# Altium schematic sheet Sensors.SchDoc
size A
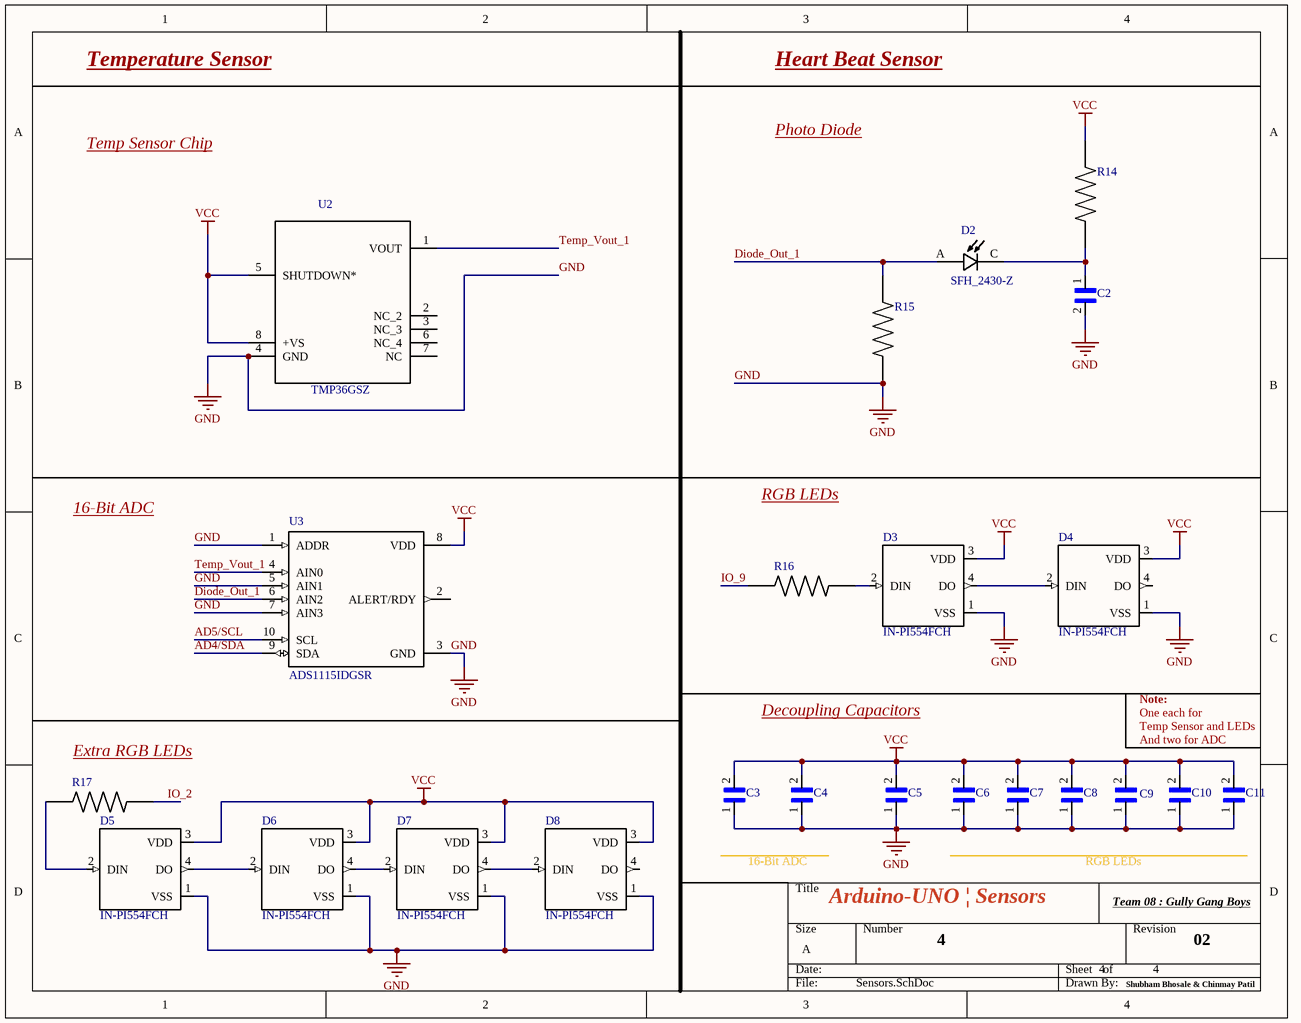
[diagram p0: Sensors.SchDoc]

## Parts
C2  CL31A226MOCLNNC  [1206_Passive]  (value not drawn)
C3  CL31A226MOCLNNC  [1206_Passive]  (value not drawn)
C4  CL31A226MOCLNNC  [1206_Passive]  (value not drawn)
C5  CL31A226MOCLNNC  [1206_Passive]  (value not drawn)
C6  CL31A226MOCLNNC  [1206_Passive]  (value not drawn)
C7  CL31A226MOCLNNC  [1206_Passive]  (value not drawn)
C8  CL31A226MOCLNNC  [1206_Passive]  (value not drawn)
C9  CL31A226MOCLNNC  [1206_Passive]  (value not drawn)
C10  CL31A226MOCLNNC  [1206_Passive]  (value not drawn)
C11  CL31A226MOCLNNC  [1206_Passive]  (value not drawn)
D2  SFH_2430-Z  [*DIO_SFH_2430-Z_SFH_2430-Z(Primary)]
D3  IN-PI554FCH  [*LED_IN-PI554FCH]
D4  IN-PI554FCH  [*LED_IN-PI554FCH]
D5  IN-PI554FCH  [*LED_IN-PI554FCH]
D6  IN-PI554FCH  [*LED_IN-PI554FCH]
D7  IN-PI554FCH  [*LED_IN-PI554FCH]
D8  IN-PI554FCH  [*LED_IN-PI554FCH]
R14  RNCP1206FTD1K00  [1206_Passive]  (value not drawn)
R15  RMCF1206JT1M00  [1206_Passive]  (value not drawn)
R16  RNCP1206FTD1K00  [1206_Passive]  (value not drawn)
R17  RNCP1206FTD1K00  [1206_Passive]  (value not drawn)
U2  TMP36GSZ  [*SOIC127P600X175-8N]
U3  ADS1115IDGSR  [*SOP50P490X110-10N]

## Nets
GND: C2.2 C3.1 C4.1 C5.1 C6.1 C7.1 C8.1 C9.1 C10.1 C11.1 D3.1(VSS) D4.1(VSS) D5.1(VSS) D6.1(VSS) D7.1(VSS) D8.1(VSS) R15.2 U2.4(GND) U3.1(ADDR) U3.3(GND) U3.5(AIN1) U3.7(AIN3)
VCC: C3.2 C4.2 C5.2 C6.2 C7.2 C8.2 C9.2 C10.2 C11.2 D3.3(VDD) D4.3(VDD) D5.3(VDD) D6.3(VDD) D7.3(VDD) D8.3(VDD) R14.2 U2.5(SHUTDOWN*) U2.8(+VS) U3.8(VDD)
AD4/SDA: U3.9(SDA)
AD5/SCL: U3.10(SCL)
Diode_Out_1: D2.A R15.1 U3.6(AIN2)
IO_2: R17.2
IO_9: R16.1
Temp_Vout_1: U2.1(VOUT) U3.4(AIN0)
NetC2_1: C2.1 D2.C R14.1
NetD3_2: D3.2(DIN) R16.2
NetD3_4: D3.4(DO) D4.2(DIN)
NetD5_2: D5.2(DIN) R17.1
NetD5_4: D5.4(DO) D6.2(DIN)
NetD6_4: D6.4(DO) D7.2(DIN)
NetD7_4: D7.4(DO) D8.2(DIN)

Not connected (* = marked no-connect by the designer): D4 4(DO); D8 4(DO); U2 2(NC_2) 3(NC_3) 6(NC_4) 7(NC); U3 2(ALERT/RDY)

## Notes on the sheet
- Temperature Sensor
- Heart Beat Sensor
- Temp Sensor Chip
- Photo Diode
- RGB LEDs
- 16-Bit ADC
- Note:
- (near R17) Extra RGB LEDs
- Decoupling Capacitors
- Temp Sensor and LEDs
- And two for ADC
- One each for
- Arduino-UNO | Sensors
- Team 08 : Gully Gang Boys
- 4
- 02
- Shubham Bhosale & Chinmay Patil

## Library data of the parts
C2-C11 = 1206_22uF: 22µF ±20% 16V Ceramic Capacitor X5R 1206 (3216 Metric); Value: CAP CER 22UF 16V X5R 1206; Digikey Link: https://www.digikey.com/product-detail/en/CL31A226MOCLNNC/1276-2728-1-ND/3890814/?itemSeq=304982363; Digikey Part: 1276-2728-1-ND
D2 = SFH_2430-Z: PHOTODIODE 570NM SMD; MF: OSRAM Opto; MP: SFH 2430-Z; SnapEDA_Link: https://www.snapeda.com/parts/SFH%202430-Z/OSRAM%20Opto%20Semiconductors%20Inc./view-part/?ref=snap; Price: None; Package: SMD-2 Osram Opto; Availability: Unavailable; Value: *
D3-D8 = IN-PI554FCH: / 5050RGB with integrated IC built in 4 PIN Â•Viewing angle: 120 degrees /; MF: Inolux; Package: SMD-4 Innolux; MP: IN-PI554FCH; Price: None; Availability: Unavailable; SnapEDA_Link: https://www.snapeda.com/parts/IN-PI554FCH/Inolux/view-part/?ref=snap; Value: *
R14 R16 R17 = 1206_1K: 1 kOhms ±1% 0.5W, 1/2W Chip Resistor 1206 (3216 Metric) Anti-Sulfur, Moisture Resistant Thin Film; Value: RES 1K OHM 1% 1/2W 1206; Digikey Link: https://www.digikey.com/product-detail/en/RNCP1206FTD1K00/RNCP1206FTD1K00CT-ND/2240675/?itemSeq=304982373; Digikey Part: RNCP1206FTD1K00CT-ND
R15 = 1206_1M: 1 MOhms ±5% 0.25W, 1/4W Chip Resistor 1206 (3216 Metric) Automotive AEC-Q200 Thick Film; Value: RES 1M OHM 5% 1/4W 1206; Digikey Link: https://www.digikey.com/product-detail/en/RMCF1206JT1M00/RMCF1206JT1M00CT-ND/1942830/?itemSeq=304982358; Digikey Part: Number RMCF1206JT1M00CT-ND
U2 = TMP36GSZ: Temp Sensor Analog_Voltage_ Serial _2-Wire_ 8-Pin SOIC N Tube; MF: Analog Devices; MP: TMP36GSZ; Package: SOIC-8 Analog Devices; Price: None; SnapEDA_Link: https://www.snapeda.com/parts/TMP36GSZ/Analog%20Devices%20Inc./view-part/?ref=snap; Availability: Unavailable; Value: *
U3 = ADS1115IDGSR: 16-Bit ADC with Integrated MUX, PGA, Comparator, Oscillator, and Reference 10-VSSOP -40 to 125; MF: Texas Instruments; MP: ADS1115IDGSR; Package: MSOP-10 Texas Instruments; SnapEDA_Link: https://www.snapeda.com/parts/ADS1115IDGSR/Texas%20Instruments/view-part/?ref=snap; Digi-Key_Part_Number: 296-38849-1-ND; Digi-Key_Purchase_URL: https://www.digikey.com/product-detail/en/texas-instruments/ADS1115IDGSR/296-38849-1-ND/5142969?utm_source=snapeda&utm_medium=aggregator&utm_campaign=symbol; Value: *